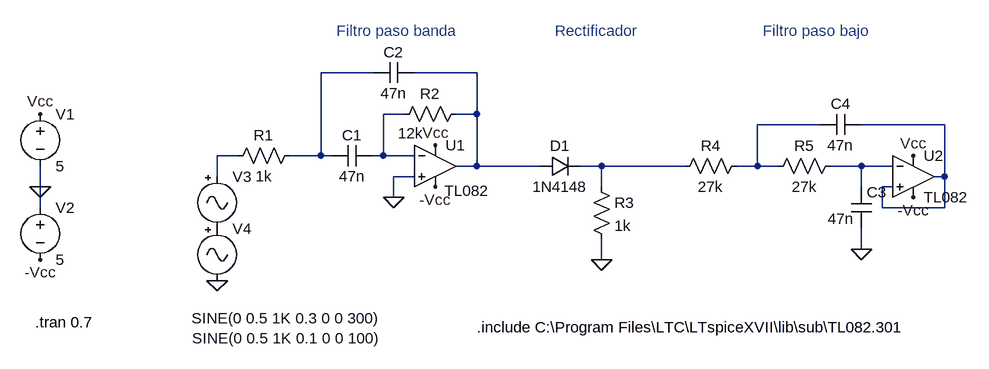
[diagram p0: schematic CELT.asc]
CELT.asc, the LTspice schematic file:
Version 4
SHEET 1 1156 680
WIRE 176 16 96 16
WIRE 336 16 240 16
WIRE 224 80 192 80
WIRE 336 80 336 16
WIRE 336 80 304 80
WIRE 864 96 768 96
WIRE 1056 96 928 96
WIRE -32 144 -64 144
WIRE 96 144 96 16
WIRE 96 144 48 144
WIRE 112 144 96 144
WIRE 192 144 192 80
WIRE 192 144 176 144
WIRE 240 144 192 144
WIRE 336 160 336 80
WIRE 336 160 304 160
WIRE 432 160 336 160
WIRE 528 160 496 160
WIRE 656 160 528 160
WIRE 768 160 768 96
WIRE 768 160 736 160
WIRE 800 160 768 160
WIRE 928 160 880 160
WIRE 976 160 928 160
WIRE -64 176 -64 144
WIRE 240 176 208 176
WIRE 1056 176 1056 96
WIRE 1056 176 1040 176
WIRE -336 192 -336 160
WIRE 528 192 528 160
WIRE 928 192 928 160
WIRE 976 192 960 192
WIRE 208 208 208 176
WIRE -336 224 -336 192
WIRE 960 224 960 192
WIRE 1056 224 1056 176
WIRE 1056 224 960 224
WIRE 928 288 928 256
WIRE 528 304 528 272
FLAG 208 208 0
FLAG -336 192 0
FLAG -336 80 Vcc
FLAG -336 304 -Vcc
FLAG 272 128 Vcc
FLAG 272 192 -Vcc
FLAG -64 336 0
FLAG 528 304 0
FLAG 928 288 0
FLAG 1008 144 Vcc
FLAG 1008 208 -Vcc
SYMBOL res 64 128 R90
WINDOW 0 0 56 VBottom 2
WINDOW 3 32 56 VTop 2
SYMATTR InstName R1
SYMATTR Value 1k
SYMBOL cap 176 128 R90
WINDOW 0 0 32 VBottom 2
WINDOW 3 32 32 VTop 2
SYMATTR InstName C1
SYMATTR Value 47n
SYMBOL Opamps\\opamp2 272 96 R0
WINDOW 3 14 102 Left 2
SYMATTR Value TL082
SYMATTR InstName U1
SYMBOL voltage -336 64 R0
WINDOW 123 0 0 Left 0
WINDOW 39 0 0 Left 0
SYMATTR InstName V1
SYMATTR Value 5
SYMBOL voltage -336 208 R0
WINDOW 123 0 0 Left 0
WINDOW 39 0 0 Left 0
SYMATTR InstName V2
SYMATTR Value 5
SYMBOL res 320 64 R90
WINDOW 0 0 56 VBottom 2
WINDOW 3 30 86 VTop 2
SYMATTR InstName R2
SYMATTR Value 12k
SYMBOL cap 240 0 R90
WINDOW 0 0 32 VBottom 2
WINDOW 3 32 32 VTop 2
SYMATTR InstName C2
SYMATTR Value 47n
SYMBOL Misc\\signal -64 160 R0
WINDOW 3 -39 234 Left 2
WINDOW 123 0 0 Left 0
WINDOW 39 0 0 Left 0
SYMATTR Value SINE(0 0.5 1K 0.3 0 0 300)
SYMATTR InstName V3
SYMBOL Misc\\signal -64 240 R0
WINDOW 3 -38 185 Left 2
WINDOW 123 0 0 Left 0
WINDOW 39 0 0 Left 0
SYMATTR Value SINE(0 0.5 1K 0.1 0 0 100)
SYMATTR InstName V4
SYMBOL diode 432 176 R270
WINDOW 0 32 32 VTop 2
WINDOW 3 0 32 VBottom 2
SYMATTR InstName D1
SYMATTR Value 1N4148
SYMBOL res 512 176 R0
SYMATTR InstName R3
SYMATTR Value 1k
SYMBOL res 752 144 R90
WINDOW 0 0 56 VBottom 2
WINDOW 3 32 56 VTop 2
SYMATTR InstName R4
SYMATTR Value 27k
SYMBOL res 896 144 R90
WINDOW 0 0 56 VBottom 2
WINDOW 3 32 56 VTop 2
SYMATTR InstName R5
SYMATTR Value 27k
SYMBOL cap 912 192 R0
WINDOW 3 -36 49 Left 2
SYMATTR Value 47n
SYMATTR InstName C3
SYMBOL Opamps\\opamp2 1008 112 R0
SYMATTR InstName U2
SYMATTR Value TL082
SYMBOL cap 928 80 R90
WINDOW 0 0 32 VBottom 2
WINDOW 3 32 32 VTop 2
SYMATTR InstName C4
SYMATTR Value 47n
TEXT 336 408 Left 2 !.include C:\\Program Files\\LTC\\LTspiceXVII\\lib\\sub\\TL082.301
TEXT -344 400 Left 2 !.tran 0.7
TEXT 120 -48 Left 2 ;Filtro paso banda
TEXT 776 -48 Left 2 ;Filtro paso bajo
TEXT 456 -48 Left 2 ;Rectificador

The netlist it stands for:
* CELT.asc
R1 N001 N006 1k
C1 N003 N001 47n
XU1 0 N003 Vcc -Vcc N002 TL082  ; pins In+ In- V+ V- OUT
V1 Vcc 0 5
V2 0 -Vcc 5
R2 N002 N003 12k
C2 N002 N001 47n
V3 N006 P001 SINE(0 0.5 1K 0.3 0 0 300)
V4 P001 0 SINE(0 0.5 1K 0.1 0 0 100)
D1 N002 N007 1N4148
R3 N007 0 1k
R4 N004 N007 27k
R5 N008 N004 27k
C3 N008 0 47n
XU2 N005 N008 Vcc -Vcc N005 TL082  ; pins In+ In- V+ V- OUT
C4 N005 N004 47n
.model D D
.lib standard.dio
.include C:\Program Files\LTC\LTspiceXVII\lib\sub\TL082.301
.tran 0.7
* Filtro paso banda
* Filtro paso bajo
* Rectificador
.backanno
.end